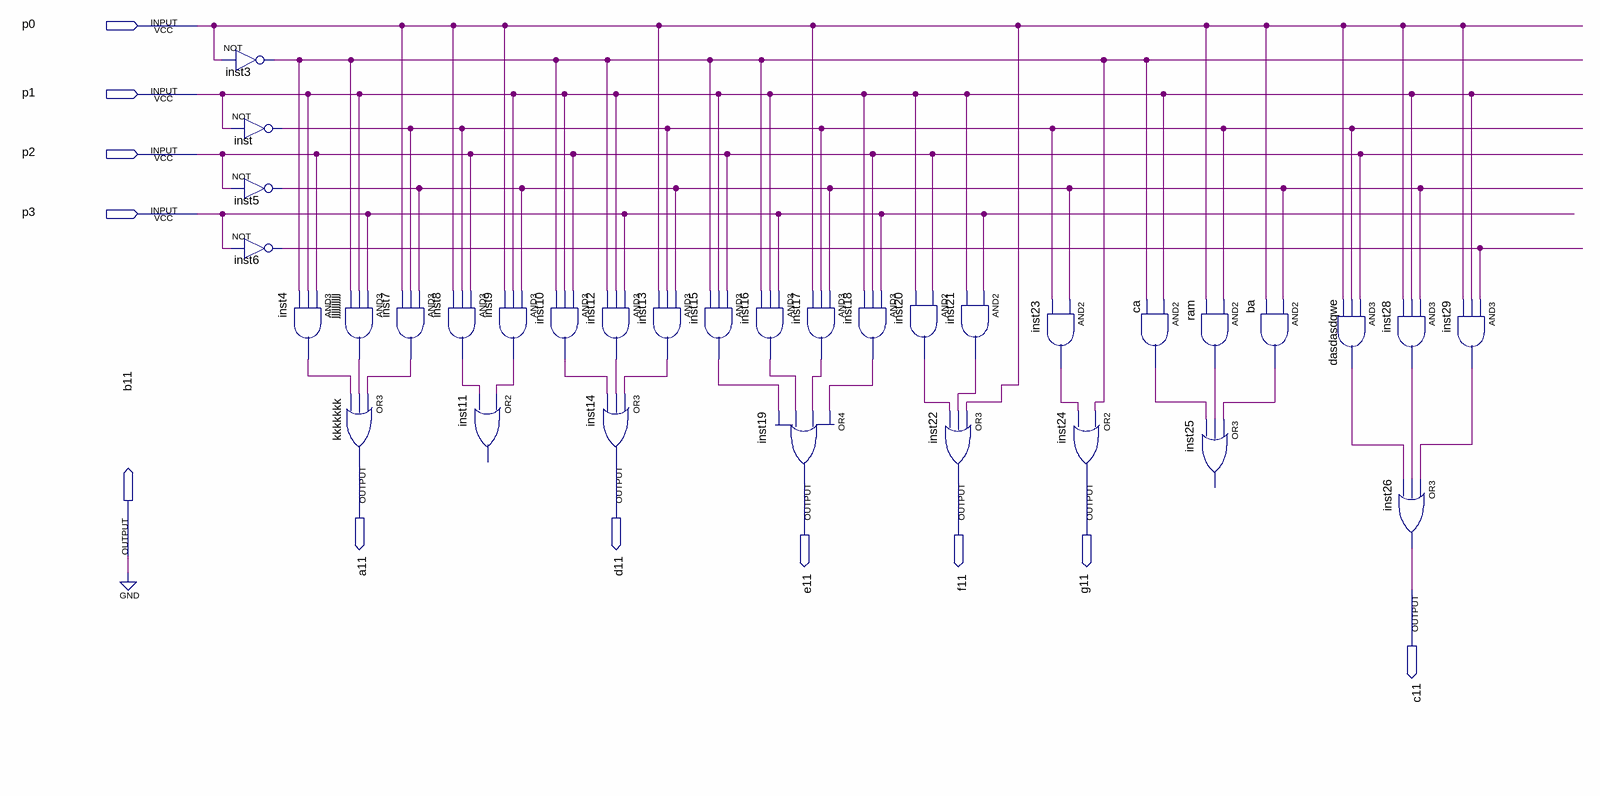
[diagram p0: schematic sheet]
// Quartus schematic dezena30final.bdf as structural Verilog: 33 symbols, 11 pins
module dezena30final (
  input  p0,
  input  p1,
  input  p2,
  input  p3,
  output a11,
  output d11,
  output e11,
  output f11,
  output g11,
  output b11,
  output c11
);

  wire ba_out, ca_out, dasdasdqwe_out, inst3_out, inst4_out, inst5_out, inst6_out, inst7_out, inst8_out,
       inst9_out, inst10_out, inst12_out, inst13_out, inst15_out, inst16_out, inst17_out, inst18_out,
       inst20_out, inst21_out, inst23_out, inst28_out, inst29_out, inst_out, jjjjjjjjjj_out, ram_out;

  not inst3 (inst3_out, p0);
  not inst (inst_out, p1);
  not inst5 (inst5_out, p2);
  not inst6 (inst6_out, p3);
  and inst4 (inst4_out, p2, p1, inst3_out);
  and jjjjjjjjjj (jjjjjjjjjj_out, p3, p1, inst3_out);
  or kkkkkkk (a11, inst7_out, jjjjjjjjjj_out, inst4_out);
  and inst7 (inst7_out, inst5_out, inst_out, p0);
  and inst9 (inst9_out, inst5_out, p1, p0);
  and inst8 (inst8_out, p2, inst_out, p0);
  // OR2 inst11 has open pins: IN1=inst9_out, IN2=inst8_out, OUT=open
  and inst10 (inst10_out, p2, p1, inst3_out);
  and inst12 (inst12_out, p3, p1, inst3_out);
  or inst14 (d11, inst13_out, inst12_out, inst10_out);
  and inst13 (inst13_out, inst5_out, inst_out, p0);
  and inst15 (inst15_out, p2, p1, inst3_out);
  and inst16 (inst16_out, p3, p1, inst3_out);
  or inst19 (e11, inst18_out, inst17_out, inst16_out, inst15_out);
  and inst17 (inst17_out, inst5_out, inst_out, p0);
  and inst18 (inst18_out, p3, p2, p1);
  and inst20 (inst20_out, p2, p1);
  and inst21 (inst21_out, p3, p1);
  or inst22 (f11, p0, inst21_out, inst20_out);
  and inst23 (inst23_out, inst5_out, inst_out);
  or inst24 (g11, inst3_out, inst23_out);
  and ca (ca_out, p1, inst3_out);
  and ram (ram_out, inst_out, p0);
  and ba (ba_out, inst5_out, p0);
  // OR3 inst25 has open pins: IN1=ba_out, IN2=ram_out, IN3=ca_out, OUT=open
  and inst28 (inst28_out, inst5_out, p1, p0);
  and dasdasdqwe (dasdasdqwe_out, p2, inst_out, p0);
  or inst26 (c11, inst29_out, inst28_out, dasdasdqwe_out);
  and inst29 (inst29_out, inst6_out, p1, p0);

  assign b11 = 1'b0;
endmodule
